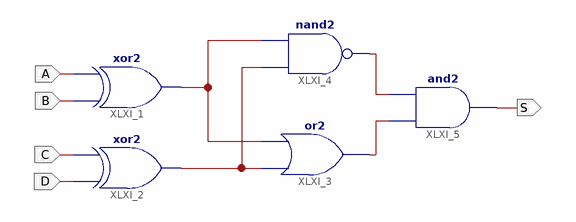
[diagram p0: schematic sheet 1]
// Xilinx ISE schematic parImpar.sch (artix7) as structural Verilog: 5 symbols, 5 ports
module parImpar (
  input  A,
  input  B,
  input  C,
  input  D,
  output S
);

  wire XLXN_3, XLXN_4, XLXN_5, XLXN_7;

  xor XLXI_1 (XLXN_3, B, A);
  xor XLXI_2 (XLXN_4, D, C);
  or XLXI_3 (XLXN_7, XLXN_4, XLXN_3);
  nand XLXI_4 (XLXN_5, XLXN_4, XLXN_3);
  and XLXI_5 (S, XLXN_7, XLXN_5);
endmodule
